# Altium project PCB_WiFi Micro SD.PrjPcb
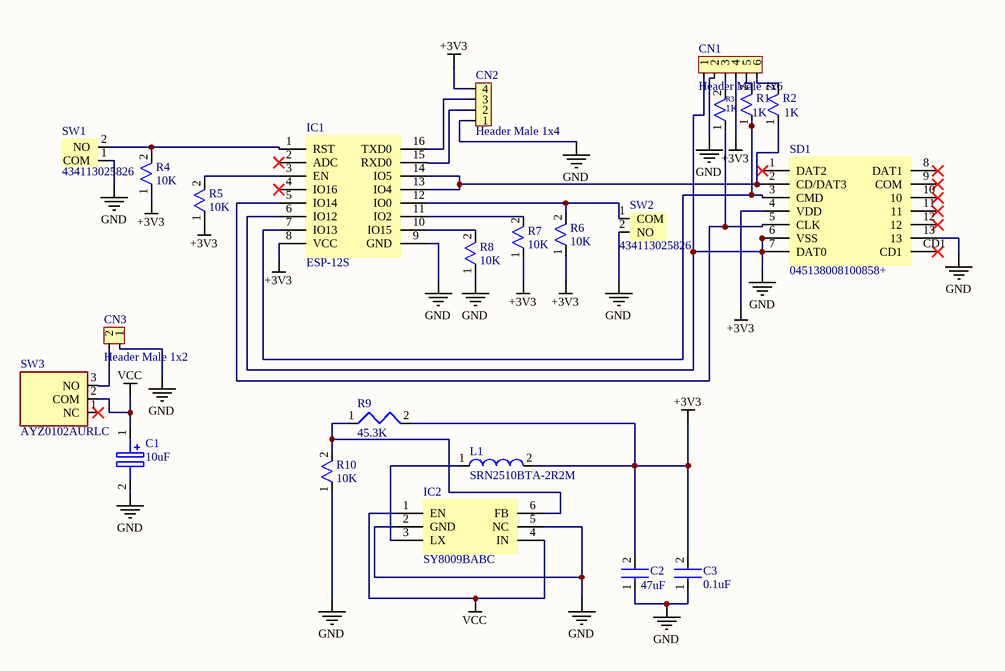
[diagram p0: Schematic.SchDoc]
1 sheet, 23 parts. Net scope: global (net labels, ports and power ports of the same name join across sheets).
Board file: PCB Layout.PcbDoc

## Sheet Schematic.SchDoc
size A4

### Parts
C1  10uF  [TPSA106K006R1500]
C2  47uF  [1210]
C3  0.1uF  [0603]
CN1  Header Male 1x6  [1x6]
CN2  Header Male 1x4  [1x4]
CN3  Header Male 1x2  [1x2]
IC1  ESP-12S  [ESP-12S]
IC2  SY8009BABC  [SY8009BABC]
L1  SRN2510BTA-2R2M  [2.5 mm x 2 mm x 0.9 mm]
R1  1K  [0805]
R2  1K  [0805]
R3  1K  [0805]
R4  10K  [0805]
R5  10K  [0805]
R6  10K  [0805]
R7  10K  [0805]
R8  10K  [0805]
R9  45.3K  [0805]
R10  10K  [0805]
SD1  045138008100858+  [045138008100858+]
SW1  434113025826  [434113025826]
SW2  434113025826  [434113025826]
SW3  AYZ0102AURLC  [AYZ0102AURLC]

### Nets
+3V3: C2.2 C3.2 CN1.4 CN2.4 IC1.8(VCC) L1.2 R4.1 R5.1 R6.1 R7.1 R9.2 SD1.4(VDD)
GND: C1.2(-) C2.1 C3.1 CN1.1 CN1.2 CN2.1 CN3.1 IC1.6(IO12) IC1.9(GND) IC2.2(GND) IC2.5(NC) R8.1 R10.1 SD1.6(VSS) SD1.7(DAT0) SD1.13 SW1.1(COM) SW2.2(NO)
VCC: C1.1(+) IC2.1(EN) IC2.4(IN) SW3.2(COM)
NetCN1_3: CN1.3 R3.2
NetCN1_5: CN1.5 R1.2
NetCN1_6: CN1.6 R2.2
NetCN2_2: CN2.2 IC1.15(RXD0)
NetCN2_3: CN2.3 IC1.16(TXD0)
NetCN3_2: CN3.2 SW3.3(NO)
NetIC1_1: IC1.1(RST) R4.2 SW1.2(NO)
NetIC1_3: IC1.3(EN) R5.2
NetIC1_5: IC1.5(IO14) R3.1 SD1.5(CLK)
NetIC1_7: IC1.7(IO13) R1.1 SD1.3(CMD)
NetIC1_10: IC1.10(IO15) R8.2
NetIC1_11: IC1.11(IO2) R7.2
NetIC1_12: IC1.12(IO0) R6.2 SW2.1(COM)
NetIC1_13: IC1.13(IO4) IC1.14(IO5) R2.1 SD1.2(CD/DAT3)
NetIC2_3: IC2.3(LX) L1.1
NetIC2_6: IC2.6(FB) R9.1 R10.2

Not connected (* = marked no-connect by the designer): IC1 2(ADC)* 4(IO16)*; SD1 1(DAT2)* 8(DAT1)* 9(COM)* 10* 11* 12* CD1*; SW3 1(NC)*

### Library data of the parts
C1 = TPSA106K006R1500: Cap Tant Solid 10uF 6.3V A CASE 10% (3.2 X 1.6 X 1.6mm) SMD 3216-18 1.5 Ohm 125AHA T/R; Manufacturer: Kyocera AVX; Life (Hours): 1000Hour; Supplier 1: Digikey; Supplier Part Number 1: 478-2388-1-ND; Manufacturer Part Number: TPSA106K006R1500; RoHS: Yes; Category: Tantalum Capacitors; Stock 1: 29007; Pricing 1: 1=0.5, 10=0.333, 50=0.2648, 100=0.2187, 500=0.17084, 1000=0.14521 (USD); ComponentLink1URL: https://datasheet.ciiva.com/11793/0900766b80066cb4-11793070.pdf?src-supplier=Rs; ComponentLink1Description: https://datasheet.ciiva.com/11793/0900766b80066cb4-11793070.pdf?src-supplier=Rs; ComponentLink2URL: https://datasheet.ciiva.com/19458/2022203-19458874.pdf?src-supplier=Jameco; ComponentLink2Description: https://datasheet.ciiva.com/19458/2022203-19458874.pdf?src-supplier=Jameco; ComponentLink3URL: https://datasheet.ciiva.com/26341/806582-da-01-en-smd-tantal10uf-6-3v-10-1-500r-2000st-26341833.pdf?src-supplier=Conrad; ComponentLink3Description: https://datasheet.ciiva.com/26341/806582-da-01-en-smd-tantal10uf-6-3v-10-1-500r-2000st-26341833.pdf?src-supplier=Conrad; ComponentLink4URL: https://datasheet.ciiva.com/12883/tps-23028-12883222.pdf?src-supplier=Mouser; ComponentLink4Description: https://datasheet.ciiva.com/12883/tps-23028-12883222.pdf?src-supplier=Mouser; ComponentLink5URL: https://datasheet.ciiva.com/14594/70001047-14594397.pdf?src-supplier=Allied+Electronics; ComponentLink5Description: https://datasheet.ciiva.com/14594/70001047-14594397.pdf?src-supplier=Allied+Electronics; ComponentLink6URL: https://datasheet.ciiva.com/22706/1441576-22706887.pdf?src-supplier=Element14; ComponentLink6Description: https://datasheet.ciiva.com/22706/1441576-22706887.pdf?src-supplier=Element14; ComponentLink7URL: https://datasheet.ciiva.com/7730/1441576-7730861.pdf?src-supplier=Element14; ComponentLink7Description: https://datasheet.ciiva.com/7730/1441576-7730861.pdf?src-supplier=Element14; ComponentLink8URL: https://datasheet.ciiva.com/7730/1680477-7730862.pdf?src-supplier=Element14; ComponentLink8Description: https://datasheet.ciiva.com/7730/1680477-7730862.pdf?src-supplier=Element14; ComponentLink9URL: https://datasheet.ciiva.com/3004/tps-3004580.pdf?src-supplier=Avnet; ComponentLink9Description: https://datasheet.ciiva.com/3004/tps-3004580.pdf?src-supplier=Avnet; ComponentLink10URL: https://datasheet.ciiva.com/263/tps-263896.pdf?src-supplier=Digikey; ComponentLink10Description: https://datasheet.ciiva.com/263/tps-263896.pdf?src-supplier=Digikey; ComponentLink11URL: https://datasheet.ciiva.com/263/tps-263897.pdf?src-supplier=Digikey; ComponentLink11Description: https://datasheet.ciiva.com/263/tps-263897.pdf?src-supplier=Digikey; ComponentLink12URL: https://datasheet.ciiva.com/263/tps-263898.pdf?src-supplier=Digikey; ComponentLink12Description: https://datasheet.ciiva.com/263/tps-263898.pdf?src-supplier=Digikey; ComponentLink13URL: https://datasheet.ciiva.com/16380/tps-16380155.pdf?src-supplier=Future+Electronics; ComponentLink13Description: https://datasheet.ciiva.com/16380/tps-16380155.pdf?src-supplier=Future+Electronics
C2 = 12103D476MAT2A: Ceramic Capacitor, Multilayer, Ceramic, 25V, 20% +Tol, 20% -Tol, X5R, 15% TC, 47uF, Surface Mount, 1210; Manufacturer: Kyocera AVX; Material: 4241ConductorMaterial; Dielectric: 1537DielectricType; Supplier 1: Mouser; Supplier Part Number 1: 581-12103D476MAT2A; Manufacturer Part Number: 12103D476MAT2A; RoHS: Yes; Category: Ceramic Capacitors; Stock 1: 27598; Pricing 1: 1=2.75, 10=2.12, 50=1.94, 100=1.61, 1000=1.09, 10000=1.04 (USD); Case/Package: 351Case; Min Operating Temperature: -55°C; Max Operating Temperature: 85°C; Capacitance: 47uF; Tolerance: 20%; Voltage Rating: 25V; Voltage Rating (DC): 25V; Height: 2.79mm; RoHS Compliant: Yes
C3 = 06035C104K4T4A: Multilayer Ceramic Capacitor, 0.1 uF, 50 V, ± 10%, X7R, 0603 [1608 Metric]; Manufacturer: Kyocera AVX; Capacitance: 100nF; Voltage Rating: 50V; Supplier 1: Digikey; Supplier Part Number 1: 478-KAM15AR71H104KMCT-ND; Manufacturer Part Number: 06035C104K4T4A; RoHS: Yes; Category: Ceramic Capacitors; Stock 1: 15963; Pricing 1: 1=0.1, 10=0.065, 50=0.037, 100=0.0287, 500=0.02164, 1000=0.017, 2500=0.01545, 5000=0.01421 (USD); Mount: Surface Mount; Case/Package: 0603; Case Code (Imperial): 0603; Case Code (Metric): 1608; Min Operating Temperature: -55°C; Max Operating Temperature: 125°C; Packaging: Tape and Reel; Package Quantity: 10000; Tolerance: 10%; Termination: SMD/SMT; Series: -; Voltage Rating (DC): 50V; Length: 0.063inch; Width: 0.032inch; Thickness: 0.035inch; Ratings: AEC-Q200; RoHS Compliant: Yes; Lead Free: 5697LeadFree; ComponentLink1URL: https://datasheet.ciiva.com/13197/cx7r-13197961.pdf?src-supplier=Mouser; ComponentLink1Description: https://datasheet.ciiva.com/13197/cx7r-13197961.pdf?src-supplier=Mouser
CN1 = Header Male 1x6: 1x6
CN2 = Header Male 1x4: 1x4
CN3 = Header Male 1x2: 1x2
IC1 = ESP-12S: Wifi Module, 2.484Ghz, 9 I/o Port Rohs Compliant: Yes; Manufacturer: RF Solutions; Interface: I2C,SPI,UART; Sensitivity: -90dBm; Data Rate: 54Mbps; Current - Transmitting: 71mA; Bandwidth: 72MHz; Max Supply Voltage: 3.6V; Min Supply Voltage: 3V; Nominal Supply Current: 300mA; Number of GPIO: 9NUMBER; Supplier 1: Digikey; Supplier Part Number 1: ESP-12SRF-ND; Manufacturer Part Number: ESP-12S; RoHS: No; Category: RF Receivers, Transceivers; Stock 1: 59; Pricing 1: 1=10.3, 10=9.444, 25=8.5848, 100=7.7265, 250=7.08264, 500=6.43876, 1000=5.79488 (USD); Min Operating Temperature: -20°C; Max Operating Temperature: 85°C; Frequency: 2.484GHz; Max Frequency: 2.484GHz; Reach SVHC Compliant: 4186SVHC; ComponentLink1URL: http://www.farnell.com/datasheets/2575856.pdf?src-supplier=Farnell; ComponentLink1Description: http://www.farnell.com/datasheets/2575856.pdf?src-supplier=Farnell; ComponentLink2URL: https://www.rfsolutions.co.uk/downloads/1513856197DS-ESP-12S.pdf?src-supplier=Digikey; ComponentLink2Description: https://www.rfsolutions.co.uk/downloads/1513856197DS-ESP-12S.pdf?src-supplier=Digikey
IC2 = SY8009BABC: Step-down type SOT-23-6 DC-DC Converters ROHS
L1 = SRN2510BTA-2R2M: Power Inductors - SMD Ind,2x2.5x0.9mm,2.2uH+/-20%,2A,shd; Manufacturer: Bourns; Supplier 1: DigiKey; Supplier Part Number 1: 118-SRN2510BTA-2R2MTR-ND; Manufacturer Part Number: SRN2510BTA-2R2M; RoHS: No; Pricing 1: 3000=0.15675 (USD)
R1-R3 = RC0805FR-071KL: SMD Chip Resistor, 1 kOhm, ± 1%, 125 mW, 0805 [2012 Metric], Thick Film, General Purpose; Manufacturer: Yageo; Resistance: 1kR; Voltage Rating (DC): 150V; Temperature Coefficient: 100ppm/°C; Power Rating: 125mW; Supplier 1: Digikey; Supplier Part Number 1: 311-1.00KCRCT-ND; Manufacturer Part Number: RC0805FR-071KL; RoHS: Yes; Category: Chip SMD Resistors; Stock 1: 2558661; Pricing 1: 1=0.1, 10=0.025, 50=0.016, 100=0.0133, 500=0.00912, 1000=0.00787 (USD); Case/Package: 0805; Number of Pins: 2; Case Code (Metric): 2012; Case Code (Imperial): 0805; Size Code: 0805; Min Operating Temperature: -55°C; Max Operating Temperature: 155°C; Tolerance: 1%; Packaging: Tape and Reel; Resistor Type: Thick Film; Package Quantity: 1; Voltage Rating: 150V; Termination: SMD/SMT; Series: RC; Number of Terminations: 2; Max Power Dissipation: 125mW; Features: Moisture Resistant; Resistance Tolerance: 1%; Construction: Rectangular; Voltage Rating (AC): 150V; Length: 0.079inch; Width: 0.049inch; Height: 0.024inch; Depth: 1.25mm; Reach SVHC Compliant: No; Lead Free: 5697LeadFree; RoHS Compliant: Yes; Military Standard: Not; ComponentLink1URL: https://datasheet.ciiva.com/7941/1686128-7941719.pdf?src-supplier=Element14; ComponentLink1Description: https://datasheet.ciiva.com/7941/1686128-7941719.pdf?src-supplier=Element14; ComponentLink2URL: https://datasheet.ciiva.com/46385/444164-46385020.pdf?src-supplier=Element14; ComponentLink2Description: https://datasheet.ciiva.com/46385/444164-46385020.pdf?src-supplier=Element14; ComponentLink3URL: https://datasheet.ciiva.com/2456/pyu-r-int-thick-7-2456976.pdf?src-supplier=Digikey; ComponentLink3Description: https://datasheet.ciiva.com/2456/pyu-r-int-thick-7-2456976.pdf?src-supplier=Digikey; ComponentLink4URL: https://datasheet.ciiva.com/2456/pyu-r-int-thick-7-2456977.pdf?src-supplier=Digikey; ComponentLink4Description: https://datasheet.ciiva.com/2456/pyu-r-int-thick-7-2456977.pdf?src-supplier=Digikey; ComponentLink5URL: https://datasheet.ciiva.com/2456/pyu-r-int-thick-7-2456975.pdf?src-supplier=Digikey; ComponentLink5Description: https://datasheet.ciiva.com/2456/pyu-r-int-thick-7-2456975.pdf?src-supplier=Digikey; ComponentLink6URL: https://datasheet.ciiva.com/16850/rc0805-16850409.pdf?src-supplier=Future+Electronics; ComponentLink6Description: https://datasheet.ciiva.com/16850/rc0805-16850409.pdf?src-supplier=Future+Electronics
R4-R8 R10 = ERJUP6D1002V: Anti-Sulfurated Thick Film Chip Resistors/ Anti-Surge Type, 10000½, 0.5%, 0.5W; Manufacturer: Panasonic; Supplier 1: Farnell; Supplier Part Number 1: 3599201; Manufacturer Part Number: ERJUP6D1002V; RoHS: No; Stock 1: 2750; Pricing 1: 10=0.0972, 100=0.0701, 500=0.0583, 1000=0.0564, 2500=0.0517, 5000=0.0443, 25000=0.0413, 50000=0.0395 (EUR); ComponentLink1URL: http://datasheet.octopart.com/ERJUP6D1002V-Panasonic-datasheet-102570939.pdf?src-supplier=Newark; ComponentLink1Description: http://datasheet.octopart.com/ERJUP6D1002V-Panasonic-datasheet-102570939.pdf?src-supplier=Newark; ComponentLink2URL: http://datasheet.octopart.com/ERJUP6D1002V-Panasonic-datasheet-102570939.pdf?src-supplier=Farnell; ComponentLink2Description: http://datasheet.octopart.com/ERJUP6D1002V-Panasonic-datasheet-102570939.pdf?src-supplier=Farnell
R9 = RT0805DRE0745K3L: High Precision-High Stability Chip Resistor Thin Film 0805 45.3kOhm 0.5% Paper T/R; Manufacturer: Yageo; Resistance: 45.3kR; Max Power Dissipation: 125mW; Temperature Coefficient: 50ppm/°C; Voltage Rating (DC): 150V; Supplier 1: DigiKey; Supplier Part Number 1: 13-RT0805DRE0745K3LCT-ND; Manufacturer Part Number: RT0805DRE0745K3L; RoHS: Yes; Category: Chip SMD Resistors; Stock 1: 5000; Pricing 1: 1=0.1, 10=0.047, 50=0.0392, 100=0.0357, 500=0.02826, 1000=0.02534 (USD); Case/Package: 0805; Min Operating Temperature: -55°C; Max Operating Temperature: 155°C; Packaging: Tape and Reel; Tolerance: 0.5%; Number of Terminations: 2; Series: RT; Lead Free: Lead Free; RoHS Compliant: Yes; ComponentLink1URL: https://datasheet.ciiva.com/2569/pyu-rt-1-to-0-05-rohs-l-5-2569500.pdf?src-supplier=Digikey; ComponentLink1Description: https://datasheet.ciiva.com/2569/pyu-rt-1-to-0-05-rohs-l-5-2569500.pdf?src-supplier=Digikey
SD1 = 045138008100858+: T&r/Memory Card Rohs Compliant: Yes |Kyocera Avx 045138008100858+; Supplier 1: Mouser; Supplier Part Number 1: 581-045138008100858+; Manufacturer: AVX; Manufacturer Part Number: 045138008100858+; RoHS: Yes; Category: Memory Connectors; Stock 1: 26919; Pricing 1: 1=3.15, 10=2.87, 50=2.87, 100=2.53, 1000=2.27, 10000=2.27 (USD); ComponentLink1URL: https://datasheet.ciiva.com/6927/1631394-6927204.pdf?src-supplier=Newark; ComponentLink1Description: https://datasheet.ciiva.com/6927/1631394-6927204.pdf?src-supplier=Newark
SW1 SW2 = 434113025826: Switch Tactile Spst-no 0.05A 12V; Manufacturer: Wurth Electronics; Supplier 1: Digikey; Supplier Part Number 1: 732-7042-1-ND; Manufacturer Part Number: 434113025826; RoHS: Yes; Category: Tactile Switches; Stock 1: 4844; Pricing 1: 1=0.58, 1500=0.461 (USD); ComponentLink1URL: https://datasheet.ciiva.com/30466/0900766b8126b62d-30466725.pdf?src-supplier=Rs; ComponentLink1Description: https://datasheet.ciiva.com/30466/0900766b8126b62d-30466725.pdf?src-supplier=Rs; ComponentLink2URL: https://datasheet.ciiva.com/1701/434123025816-1701904.pdf?src-supplier=Newark; ComponentLink2Description: https://datasheet.ciiva.com/1701/434123025816-1701904.pdf?src-supplier=Newark; ComponentLink3URL: https://datasheet.ciiva.com/29123/711750-da-01-en-taster-434113025826-29123817.pdf?src-supplier=Conrad; ComponentLink3Description: https://datasheet.ciiva.com/29123/711750-da-01-en-taster-434113025826-29123817.pdf?src-supplier=Conrad; ComponentLink4URL: https://datasheet.ciiva.com/1532/434123025816-1532520.pdf?src-supplier=Element14; ComponentLink4Description: https://datasheet.ciiva.com/1532/434123025816-1532520.pdf?src-supplier=Element14; ComponentLink5URL: https://datasheet.ciiva.com/1633/434123025816-1633927.pdf?src-supplier=Farnell; ComponentLink5Description: https://datasheet.ciiva.com/1633/434123025816-1633927.pdf?src-supplier=Farnell
SW3 = AYZ0102AURLC: AYZ Series 100 mA 12 V SPDT On-On Surface Mount Side Actuated Slide Switch; Manufacturer: ITT C&K; Supplier 1: Rs; Supplier Part Number 1: 2624403; Manufacturer Part Number: AYZ0102AURLC; RoHS: No; Category: Uncategorized; Stock 1: 2968; Pricing 1: 2=0.865, 10=0.83, 100=0.765, 500=0.635, 1000=0.59 (GBP)